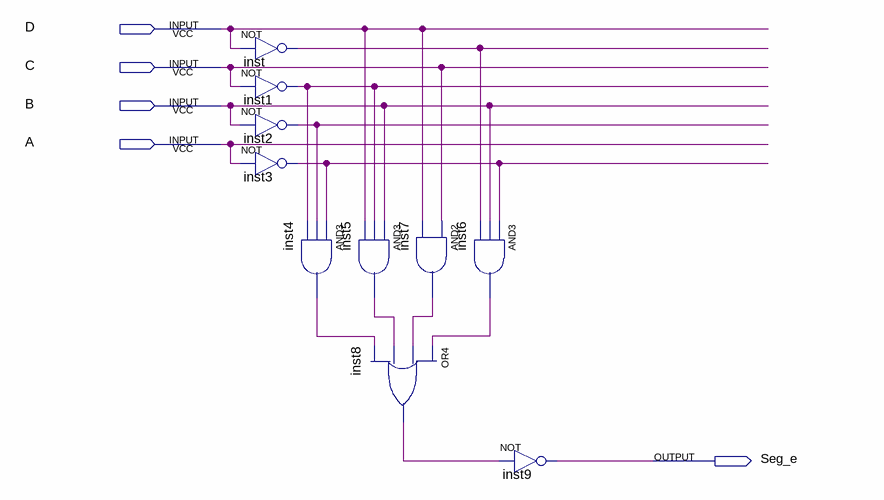
[diagram p0: schematic sheet]
// Quartus schematic Seg_e.bdf as structural Verilog: 10 symbols, 5 pins
module Seg_e (
  input  D,
  input  C,
  input  B,
  input  A,
  output Seg_e
);

  wire inst1_out, inst2_out, inst3_out, inst4_out, inst5_out, inst6_out, inst7_out, inst8_out, inst_out;

  not inst (inst_out, D);
  not inst1 (inst1_out, C);
  not inst2 (inst2_out, B);
  not inst3 (inst3_out, A);
  and inst4 (inst4_out, inst3_out, inst2_out, inst1_out);
  and inst5 (inst5_out, B, inst1_out, D);
  and inst7 (inst7_out, C, D);
  or inst8 (inst8_out, inst6_out, inst7_out, inst5_out, inst4_out);
  and inst6 (inst6_out, inst3_out, B, inst_out);
  not inst9 (Seg_e, inst8_out);
endmodule
